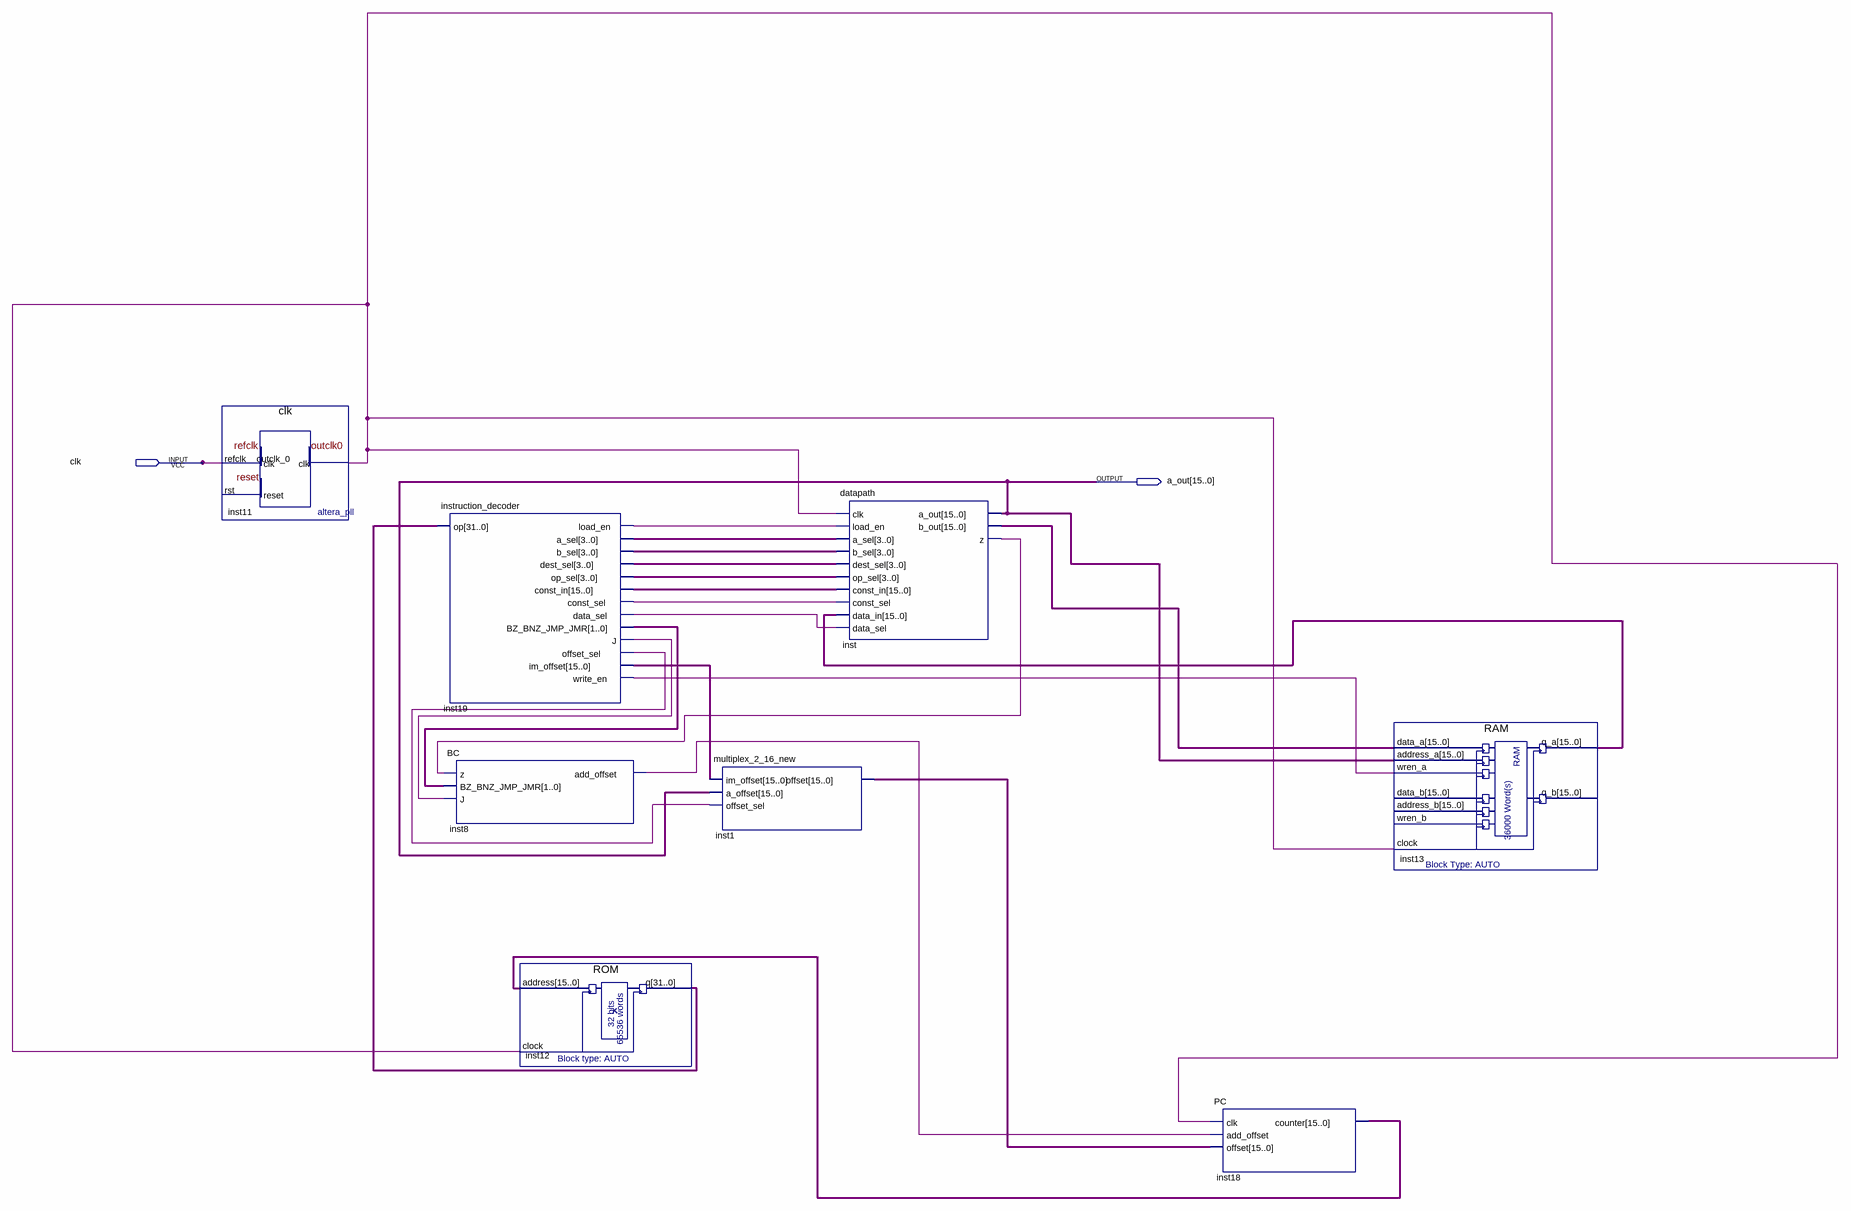
[diagram p0: schematic sheet]
// Quartus schematic MB.bdf as structural Verilog: 8 symbols, 2 pins
module MB (
  input  clk,
  output [15:0] a_out
);

  wire inst8_add_offset, inst11_outclk_0, inst19_const_sel, inst19_data_sel, inst19_j, inst19_load_en,
       inst19_offset_sel, inst19_write_en, inst_z;
  wire [1:0] inst19_bz_bnz_jmp_jmr;
  wire [3:0] inst19_a_sel, inst19_b_sel, inst19_dest_sel, inst19_op_sel;
  wire [15:0] inst1_offset, inst13_q_a, inst18_counter, inst19_const_in, inst19_im_offset, inst_b_out;
  wire [31:0] inst12_q;

  clk inst11 (.refclk(clk), .outclk_0(inst11_outclk_0));  // open: rst
  instruction_decoder inst19 (
    .op(inst12_q), .load_en(inst19_load_en), .a_sel(inst19_a_sel), .b_sel(inst19_b_sel),
    .dest_sel(inst19_dest_sel), .op_sel(inst19_op_sel), .const_in(inst19_const_in),
    .const_sel(inst19_const_sel), .data_sel(inst19_data_sel), .BZ_BNZ_JMP_JMR(inst19_bz_bnz_jmp_jmr),
    .J(inst19_j), .offset_sel(inst19_offset_sel), .im_offset(inst19_im_offset), .write_en(inst19_write_en));
  BC inst8 (.z(inst_z), .BZ_BNZ_JMP_JMR(inst19_bz_bnz_jmp_jmr), .J(inst19_j), .add_offset(inst8_add_offset));
  ROM inst12 (.address(inst18_counter), .clock(inst11_outclk_0), .q(inst12_q));
  multiplex_2_16_new inst1 (
    .im_offset(inst19_im_offset), .a_offset(a_out), .offset_sel(inst19_offset_sel), .offset(inst1_offset));
  datapath inst (
    .clk(inst11_outclk_0), .load_en(inst19_load_en), .a_sel(inst19_a_sel), .b_sel(inst19_b_sel),
    .dest_sel(inst19_dest_sel), .op_sel(inst19_op_sel), .const_in(inst19_const_in),
    .const_sel(inst19_const_sel), .data_in(inst13_q_a), .data_sel(inst19_data_sel), .a_out(a_out),
    .b_out(inst_b_out), .z(inst_z));
  PC inst18 (.clk(inst11_outclk_0), .add_offset(inst8_add_offset), .offset(inst1_offset), .counter(inst18_counter));
  RAM inst13 (
    .data_a(inst_b_out), .address_a(a_out), .wren_a(inst19_write_en), .clock(inst11_outclk_0),
    .q_a(inst13_q_a));  // open: data_b, address_b, wren_b, q_b
endmodule
